# Altium schematic sheet 01-SNESDRONE_Direct_IO_PSU.SchDoc
size A4
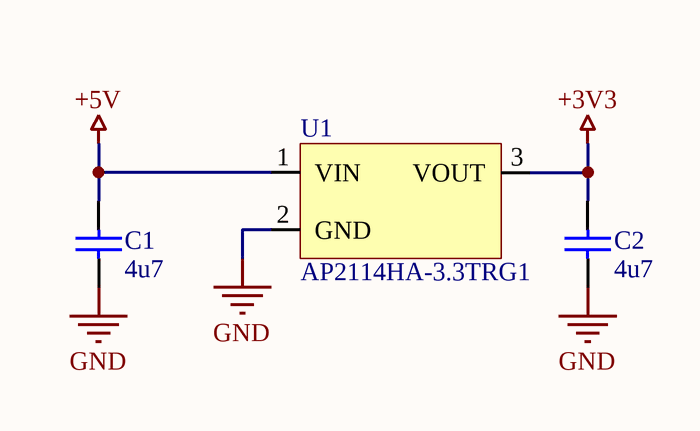
[diagram p0: 01-SNESDRONE_Direct_IO_PSU.SchDoc]

## Parts
C1  value 4u7  [cap_0603]  (hidden comment: cap_0603)
C2  value 4u7  [cap_0603]  (hidden comment: cap_0603)
U1  AP2114HA-3.3TRG1  [SOT223]

## Nets
+3V3: C2.2 U1.3(VOUT)
+5V: C1.2 U1.1(VIN)
GND: C1.1 C2.1 U1.2(GND)

## Library data of the parts
C1 C2 = cap_0603: Capacitor
U1 = AP2114HA-3.3TRG1: PMIC - Spannungsregler - Linear Positiv Fest 1 Ausgang 1A SOT-223-3